# Altium schematic sheet isolated_USB.SchDoc: foxBMS BMS-Master
size A3; DocumentNumber: 19; SheetNumber: 19; SheetTotal: 24; Author: Fraunhofer IISB foxBMS Team; REL-DATE: 2017-05-16; VERSION: 1.0.2; SheetDescription: Isolated USB MCU_0 + MCU_1
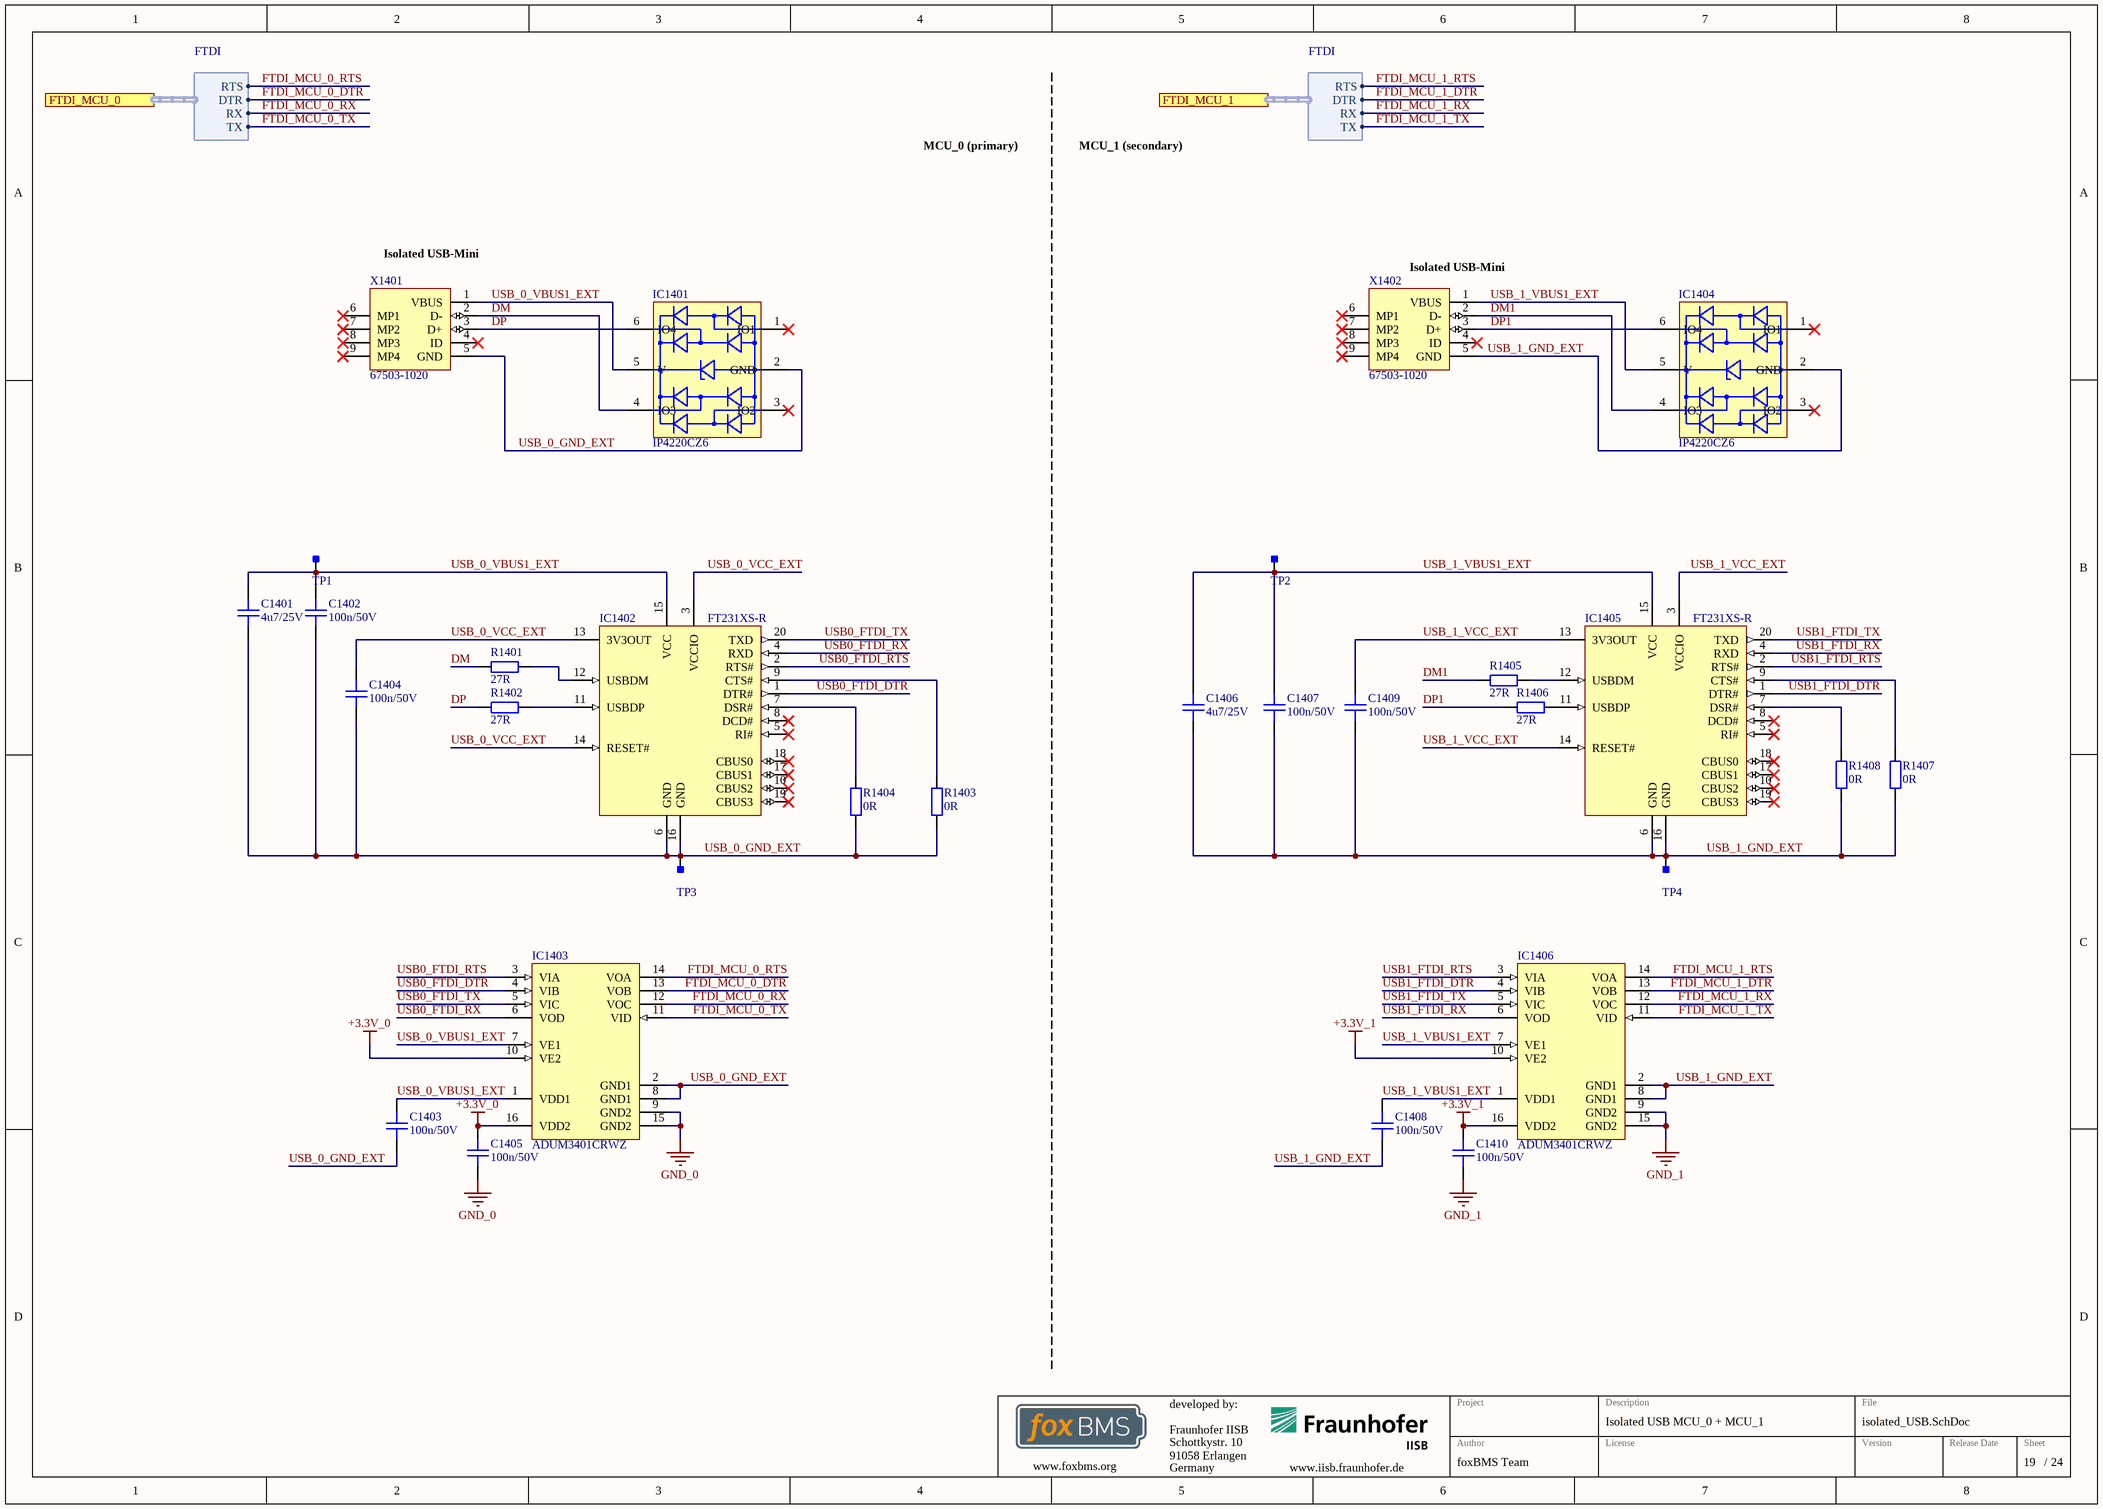
[diagram p0: isolated_USB.SchDoc]

## Parts
C1401  4u7/25V  [CAPC1608X08N]
C1402  100n/50V  [CAPC1608X08N]
C1403  100n/50V  [CAPC1608X08N]
C1404  100n/50V  [CAPC1608X08N]
C1405  100n/50V  [CAPC1608X08N]
C1406  4u7/25V  [CAPC1608X08N]
C1407  100n/50V  [CAPC1608X08N]
C1408  100n/50V  [CAPC1608X08N]
C1409  100n/50V  [CAPC1608X08N]
C1410  100n/50V  [CAPC1608X08N]
IC1401  IP4220CZ6  [TSOP95P280X110-6N]
IC1402  FT231XS-R  [SSOP-20_L]
IC1403  ADUM3401CRWZ  [ADI-RW-16_N]
IC1404  IP4220CZ6  [TSOP95P280X110-6N]
IC1405  FT231XS-R  [SSOP-20_L]
IC1406  ADUM3401CRWZ  [ADI-RW-16_N]
R1401  27R  [RESC1608X05N]
R1402  27R  [RESC1608X05N]
R1403  0R  [RESC1608X05N]
R1404  0R  [RESC1608X05N]
R1405  27R  [RESC1608X05N]
R1406  27R  [RESC1608X05N]
R1407  0R  [RESC1608X05N]
R1408  0R  [RESC1608X05N]
TP1  Testpoint_Square  [Testpoint_S1]  (value not drawn)  (no BOM)
TP2  Testpoint_Square  [Testpoint_S1]  (value not drawn)  (no BOM)
TP3  Testpoint_Square  [Testpoint_S1]  (value not drawn)  (no BOM)
TP4  Testpoint_Square  [Testpoint_S1]  (value not drawn)  (no BOM)
X1401  67503-1020  [MOLX-67503-1020_V]
X1402  67503-1020  [MOLX-67503-1020_V]

## Ports
FTDI_MCU_0 (harness FTDI), FTDI_MCU_1 (harness FTDI)

## Harnesses
FTDI: RTS, DTR, RX, TX

## Nets
+3.3V_0: C1405.1 IC1403.10(VE2) IC1403.16(VDD2)
+3.3V_1: C1410.1 IC1406.10(VE2) IC1406.16(VDD2)
GND_0: C1405.2 IC1403.9(GND2) IC1403.15(GND2)
GND_1: C1410.2 IC1406.9(GND2) IC1406.15(GND2)
DM: IC1401.4(IO3) R1401.2 X1401.2(D-)
DM1: IC1404.4(IO3) R1405.2 X1402.2(D-)
DP: IC1401.6(IO4) R1402.2 X1401.3(D+)
DP1: IC1404.6(IO4) R1406.2 X1402.3(D+)
FTDI_MCU_0_DTR: IC1403.13(VOB) ; port FTDI_MCU_0.DTR
FTDI_MCU_0_RTS: IC1403.14(VOA) ; port FTDI_MCU_0.RTS
FTDI_MCU_0_RX: IC1403.12(VOC) ; port FTDI_MCU_0.RX
FTDI_MCU_0_TX: IC1403.11(VID) ; port FTDI_MCU_0.TX
FTDI_MCU_1_DTR: IC1406.13(VOB) ; port FTDI_MCU_1.DTR
FTDI_MCU_1_RTS: IC1406.14(VOA) ; port FTDI_MCU_1.RTS
FTDI_MCU_1_RX: IC1406.12(VOC) ; port FTDI_MCU_1.RX
FTDI_MCU_1_TX: IC1406.11(VID) ; port FTDI_MCU_1.TX
USB0_FTDI_DTR: IC1402.1(DTR#) IC1403.4(VIB)
USB0_FTDI_RTS: IC1402.2(RTS#) IC1403.3(VIA)
USB0_FTDI_RX: IC1402.4(RXD) IC1403.6(VOD)
USB0_FTDI_TX: IC1402.20(TXD) IC1403.5(VIC)
USB1_FTDI_DTR: IC1405.1(DTR#) IC1406.4(VIB)
USB1_FTDI_RTS: IC1405.2(RTS#) IC1406.3(VIA)
USB1_FTDI_RX: IC1405.4(RXD) IC1406.6(VOD)
USB1_FTDI_TX: IC1405.20(TXD) IC1406.5(VIC)
USB_0_GND_EXT: C1401.2 C1402.2 C1403.2 C1404.2 IC1401.2(GND) IC1402.6(GND) IC1402.16(GND) IC1403.2(GND1) IC1403.8(GND1) R1403.2 R1404.2 TP3.1 X1401.5(GND)
USB_0_VBUS1_EXT: C1401.1 C1402.1 C1403.1 IC1401.5(V) IC1402.15(VCC) IC1403.1(VDD1) IC1403.7(VE1) TP1.1 X1401.1(VBUS)
USB_0_VCC_EXT: C1404.1 IC1402.3(VCCIO) IC1402.13(3V3OUT) IC1402.14(RESET#)
USB_1_GND_EXT: C1406.2 C1407.2 C1408.2 C1409.2 IC1404.2(GND) IC1405.6(GND) IC1405.16(GND) IC1406.2(GND1) IC1406.8(GND1) R1407.2 R1408.2 TP4.1 X1402.5(GND)
USB_1_VBUS1_EXT: C1406.1 C1407.1 C1408.1 IC1404.5(V) IC1405.15(VCC) IC1406.1(VDD1) IC1406.7(VE1) TP2.1 X1402.1(VBUS)
USB_1_VCC_EXT: C1409.1 IC1405.3(VCCIO) IC1405.13(3V3OUT) IC1405.14(RESET#)
NetIC1402_7: IC1402.7(DSR#) R1404.1
NetIC1402_9: IC1402.9(CTS#) R1403.1
NetIC1402_11: IC1402.11(USBDP) R1402.1
NetIC1402_12: IC1402.12(USBDM) R1401.1
NetIC1405_7: IC1405.7(DSR#) R1408.1
NetIC1405_9: IC1405.9(CTS#) R1407.1
NetIC1405_11: IC1405.11(USBDP) R1406.1
NetIC1405_12: IC1405.12(USBDM) R1405.1

Not connected (* = marked no-connect by the designer): IC1401 1(IO1)* 3(IO2)*; IC1402 5(RI#)* 8(DCD#)* 10(CBUS2)* 17(CBUS1)* 18(CBUS0)* 19(CBUS3)*; IC1404 1(IO1)* 3(IO2)*; IC1405 5(RI#)* 8(DCD#)* 10(CBUS2)* 17(CBUS1)* 18(CBUS0)* 19(CBUS3)*; X1401 4(ID)* 6(MP1)* 7(MP2)* 8(MP3)* 9(MP4)*; X1402 4(ID)* 6(MP1)* 7(MP2)* 8(MP3)* 9(MP4)*

## Notes on the sheet
- MCU_0 (primary)
- MCU_1 (secondary)
- (near X1401) Isolated USB-Mini
- (near X1402) Isolated USB-Mini
- Fraunhofer IISB
- Schottkystr. 10
- developed by:
- 91058 Erlangen
- Germany
- Author
- Project
- License
- Description
- File
- Version
- Release Date
- Sheet
- www.foxbms.org
- www.iisb.fraunhofer.de
- foxBMS Team
- /

## Library data of the parts
C1401 C1406 = gen_C_ceramic_4u7_25V_X5R_0603: MLCC; Capacitance: 4u7; Rated Voltage: 25V; Dielectric: X5R; Case EIA: 0603; Case Metric: 1608; AVT Set: x; Automotive Qualified: False; Part Number: gen_C_ceramic_4u7_25V_X5R_0603; Supplier 1: Farnell; Supplier Part Number 1: 2672159
C1402-C1405 C1407-C1410 = gen_C_ceramic_100n_50V_X7R_0603: MLCC; Capacitance: 100n; Rated Voltage: 50V; Dielectric: X7R; Case EIA: 0603; Case Metric: 1608; PnP Package: C_0603_10; PnP Value: 100n/50V/X7R; PnP equipped: x; Automotive Qualified: False; Part Number: gen_C_ceramic_100n_50V_X7R_0603; Supplier 1: Farnell; Supplier Part Number 1: 2525267; Supplier 2: Digikey; Supplier Part Number 2: 490-6049-1-ND
IC1401 IC1404 = nxp_IP4220CZ6,125
IP4220CZ6,125: Usb ESD protection diodes; Manufacturer: Nexperia; PnP Package: SOT457; Automotive Qualified: False; Part Number: nxp_IP4220CZ6,125 / IP4220CZ6,125; Part Name: IP4220CZ6,125; Operating Temperature: -40°C - +85°C; ComponentLink1Description: Datasheet; ComponentLink1URL: http://www.farnell.com/datasheets/1708221.pdf; Supplier 1: Farnell; Supplier Part Number 1: 1506629; Supplier 2: Digikey; Supplier Part Number 2: 1727-3578-1-ND; Supplier 3: Mouser; Supplier Part Number 3: 771-IP4220CZ6-T/R
IC1402 IC1405 = CMP-0248-00024-2: USB to Full-Handshake UART Interface Chip, UHCI/OHCI/EHCI Compatible, USB 2.0 Compatible, -40 to +85 degC, 20-Pin SSOP, Pb-Free, Tape and Reel; Manufacturer: FTDI; PackageVersion: Feb-13; PackageReference: SSOP-20; ComponentLink1Description: Manufacturer URL; ComponentLink2Description: Datasheet; PackageDescription: 20-Pin Small Outline Package, 8.6 x 3.9 mm Body, 0.635 mm Pitch; ComponentLink3URL: www.ftdichip.com/Products/ICs/FT231X.html; PartNumber: FT231XS-R; DatasheetVersion: ver 1.2, Feb-2013; ComponentLink2URL: http://www.ftdichip.com/Support/Documents/DataSheets/ICs/DS_FT231X.pdf; Code_JEDEC: MO-137-AD; ComponentLink3Description: FT231X Product Page; RevisionNote: DatasheetVersion updated to 1.2 Feb-2013; ComponentLink1URL: http://www.ftdichip.com/
IC1403 IC1406 = CMP-0534-00405-1: Quad Channel Digital Isolator, Enhanced System-Level ESD Reliability, 2.5 KV rms Insulation Rating, 90 Mbps Data Rate, 32 ns Delay, Industrial, 16-pin SOIC (RW-16), Tube; Manufacturer: Analog Devices; Insulation Rating (kVrms): 2.5; Max Data Rate: 90Mbps; PackageDescription: 16-Pin Standard Small Outline Package, Body 10.3 x 7.5 mm, Pitch 1.27 mm; ComponentLink2Description: Datasheet; Mounting Technology: Surface Mount; ComponentLink2URL: http://www.analog.com/static/imported-files/data_sheets/ADUM3400_3401_3402.pdf; ComponentLink4URL: Product URL:http://www.analog.com/en/interface-isolation/digital-isolators/adum3401/products/product.html; ComponentLink1URL: http://www.analog.com/en/index.html; ComponentLink1Description: Manufacturer URL; Max Operating Temp (degreesC): 105; PartNumber: ADUM3401CRWZ; Code_JEDEC: MS-013-AA; PackageVersion: 032707-B, 03/2007; ComponentLink3URL: http://www.analog.com/static/imported-files/packages/PKG_PDF/SOIC_WIDE%20%28RW%29/RW_16.pdf; DatasheetVersion: Rev. B; PackageReference: RW-16; ComponentLink4Description: URL Link1; ComponentLink3Description: Package Specification
R1401 R1402 R1405 R1406 = gen_R_27R_0603: SMD Resistor 27R 0603; Tolerance: 1%; Power: 0.1W; Case EIA: 0603; Case Metric: 1608; Maximum Working Voltage: 75V; PnP Package: R_0603; Automotive Qualified: False; Part Number: gen_R_27R_0603; Operating Temperature: -55°C - +155°C; Resistance: 27R; Series: E24; PnP Value: 27R; Supplier 1: Farnell; Supplier Part Number 1: 2059559
R1403 R1404 = gen_R_0R_0603: SMD Resistor 0R 0603; Power: 0.1W; Case EIA: 0603; Case Metric: 1608; PnP Package: R_0603; Maximum Working Voltage: 75V; Automotive Qualified: False; Part Number: gen_R_0R_0603; Operating Temperature: -55°C - +155°C; Resistance: 0R; Series: Jumper; PnP Value: 0R; Supplier 1: Farnell; Supplier Part Number 1: 2073345
R1407 R1408 = gen_R_0R_0603: SMD Resistor 0R 0603; Power: 0.1W; Case EIA: 0603; Case Metric: 1608; Maximum Working Voltage: 75V; PnP Package: R_0603; Automotive Qualified: False; Part Number: gen_R_0R_0603; Operating Temperature: -55°C - +155°C; Resistance: 0R; Series: Jumper; PnP Value: 0R; Supplier 1: Farnell; Supplier Part Number 1: 2073345
TP1-TP4 = Testpoint_Square: Testpoint, square; Part Number: Testpoint_Square
X1401 X1402 = CMP-0411-00002-1: USB, MINI, SMD, RA KME04-USBMU03A01; Manufacturer: Molex; ComponentLink1URL: http://www.molex.com/; PartNumber: 67503-1020; Mounting Technology: Surface Mount; ComponentLink1Description: Manufacturer URL; Terminal Pitch: 0.8 mm; DatasheetVersion: Rev F, 06/2009; ComponentLink2Description: Datasheet; PackageDescription: Mini USB Connector, SMT, Righer Angle; ComponentLink2URL: http://www.molex.com/pdm_docs/sd/675031020_sd.pdf; PackageReference: 67503-1020